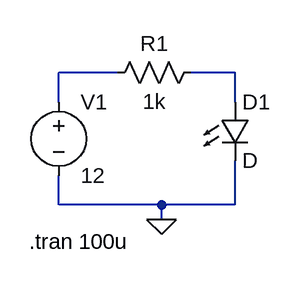
[diagram p0: schematic Draft2.asc]
Draft2.asc, the LTspice schematic file:
Version 4
SHEET 1 880 680
WIRE 96 144 32 144
WIRE 224 144 176 144
WIRE 32 176 32 144
WIRE 224 176 224 144
WIRE 32 288 32 256
WIRE 144 288 32 288
WIRE 224 288 224 240
WIRE 224 288 144 288
WIRE 144 304 144 288
FLAG 144 304 0
SYMBOL voltage 32 160 R0
WINDOW 123 0 0 Left 0
WINDOW 39 0 0 Left 0
SYMATTR InstName V1
SYMATTR Value 12
SYMBOL res 192 128 R90
WINDOW 0 0 56 VBottom 2
WINDOW 3 32 56 VTop 2
SYMATTR InstName R1
SYMATTR Value 1k
SYMBOL LED 208 176 R0
SYMATTR InstName D1
TEXT 0 328 Left 2 !.tran 100u

The netlist it stands for:
* Draft2.asc
V1 N001 0 12
R1 N002 N001 1k
D1 N002 0 D
.model D D
.lib standard.dio
.tran 100u
.backanno
.end